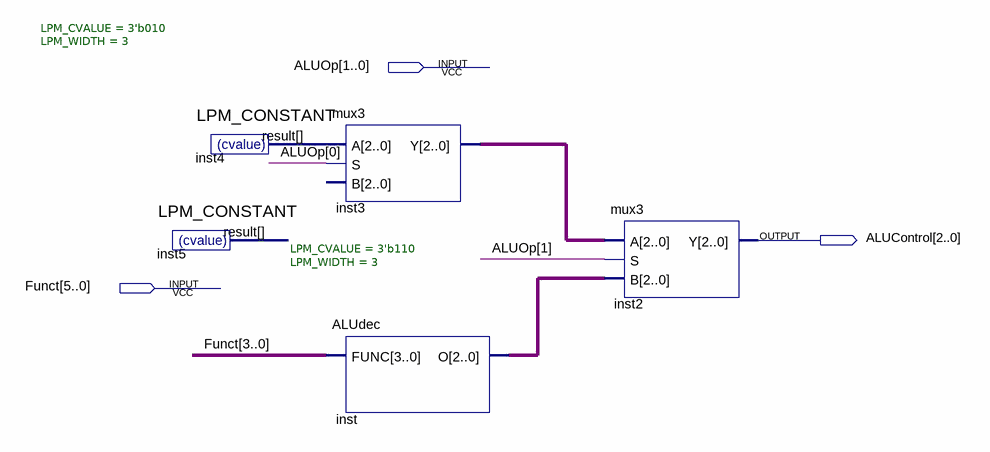
[diagram p0: schematic sheet]
// Quartus schematic ALUcL.bdf as structural Verilog: 5 symbols, 3 pins
module ALUcL (
  input  [1:0] ALUOp,
  input  [5:0] Funct,
  output [2:0] ALUControl
);

  wire [2:0] inst3_y, inst4_result, inst_o;

  LPM_CONSTANT #(.LPM_CVALUE(3'b010), .LPM_WIDTH(3)) inst4 (.result(inst4_result));
  LPM_CONSTANT #(.LPM_CVALUE(3'b110), .LPM_WIDTH(3)) inst5 ();  // open: result
  mux3 inst3 (.A(inst4_result), .S(ALUOp[0]), .Y(inst3_y));  // open: B
  ALUdec inst (.FUNC(Funct[3:0]), .O(inst_o));
  mux3 inst2 (.A(inst3_y), .S(ALUOp[1]), .B(inst_o), .Y(ALUControl));
endmodule
